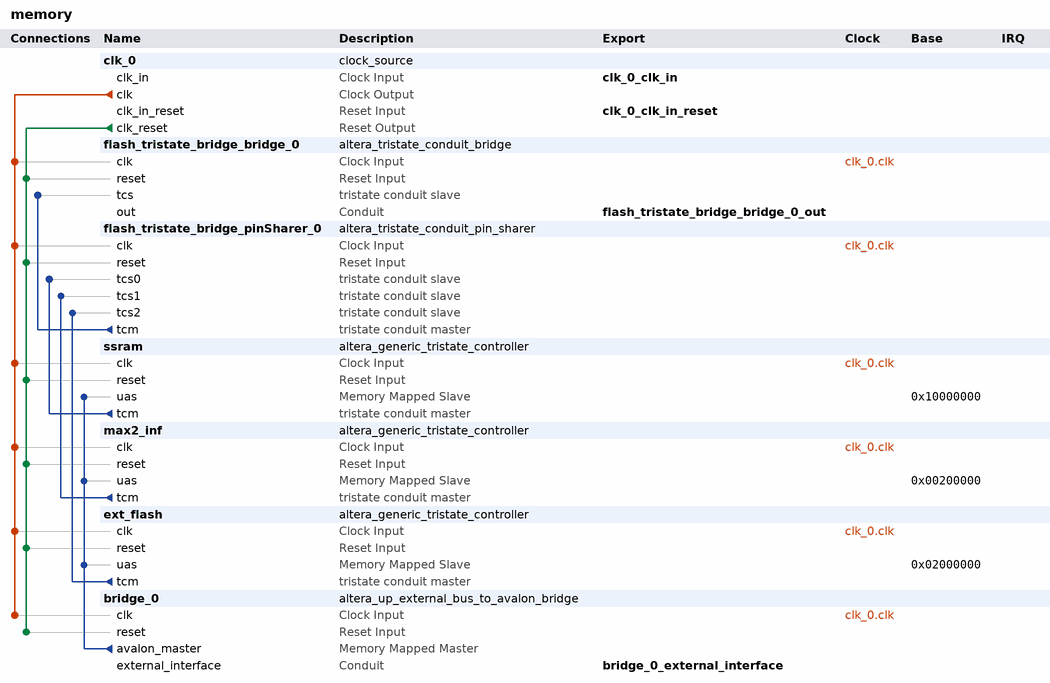
[diagram p0: system contents]
# Platform Designer (Qsys) system memory, Arria V 5AGXFB3H4F35C4
# Parameters at their usual value, and those the tool derives, are not listed.
package require -exact qsys 20.1
create_system memory
set_project_property DEVICE_FAMILY {Arria V}
set_project_property DEVICE 5AGXFB3H4F35C4

add_instance clk_0 clock_source 20.1
set_instance_parameter_value clk_0 clockFrequency 100000000

add_instance flash_tristate_bridge_bridge_0 altera_tristate_conduit_bridge 20.1

add_instance flash_tristate_bridge_pinSharer_0 altera_tristate_conduit_pin_sharer 20.1
set_instance_parameter_value flash_tristate_bridge_pinSharer_0 MODULE_ORIGIN_LIST ext_flash.tcm,ext_flash.tcm,ext_flash.tcm,ext_flash.tcm,ext_flash.tcm,max2_inf.tcm,max2_inf.tcm,max2_inf.tcm,max2_inf.tcm,max2_inf.tcm,max2_inf.tcm,max2_inf.tcm,max2_inf.tcm,ssram.tcm,ssram.tcm,ssram.tcm,ssram.tcm,ssram.tcm,ssram.tcm,ssram.tcm,ssram.tcm
set_instance_parameter_value flash_tristate_bridge_pinSharer_0 NUM_INTERFACES 3
set_instance_parameter_value flash_tristate_bridge_pinSharer_0 SHARED_SIGNAL_LIST flash_tristate_bridge_address,read_n_to_the_ext_flash,write_n_to_the_ext_flash,flash_tristate_bridge_data,select_n_to_the_ext_flash,chipenable1_n_to_the_max2_inf,bw_n_to_the_max2_inf,outputenable_n_to_the_max2_inf,bwe_n_to_the_max2_inf,flash_tristate_bridge_data,flash_tristate_bridge_address,reset_n_to_the_max2_inf,adsc_n_to_the_max2_inf,chipenable1_n_to_the_ssram,bw_n_to_the_ssram,outputenable_n_to_the_ssram,bwe_n_to_the_ssram,flash_tristate_bridge_data,flash_tristate_bridge_address,reset_n_to_the_ssram,adsc_n_to_the_ssram
set_instance_parameter_value flash_tristate_bridge_pinSharer_0 SIGNAL_ORIGIN_LIST address,read_n,write_n,data,chipselect_n,chipselect_n,byteenable_n,outputenable_n,write_n,data,address,reset_n,begintransfer_n,chipselect_n,byteenable_n,outputenable_n,write_n,data,address,reset_n,begintransfer_n

add_instance ssram altera_generic_tristate_controller 20.1
set_instance_parameter_value ssram ACTIVE_LOW_BEGINTRANSFER 1
set_instance_parameter_value ssram ACTIVE_LOW_BYTEENABLE 1
set_instance_parameter_value ssram ACTIVE_LOW_OUTPUTENABLE 1
set_instance_parameter_value ssram ACTIVE_LOW_READ 0
set_instance_parameter_value ssram ACTIVE_LOW_RESET_OUTPUT 1
set_instance_parameter_value ssram CHIPSELECT_THROUGH_READLATENCY 1
set_instance_parameter_value ssram INTERFACE_ASSIGNMENT_KEYS embeddedsw.configuration.isMemoryDevice
set_instance_parameter_value ssram INTERFACE_ASSIGNMENT_VALUES 1
set_instance_parameter_value ssram MODULE_ASSIGNMENT_KEYS embeddedsw.configuration.hwClassnameDriverSupportList,embeddedsw.CMacro.SRAM_MEMORY_SIZE,embeddedsw.CMacro.SRAM_MEMORY_UNITS,embeddedsw.CMacro.SSRAM_DATA_WIDTH,embeddedsw.CMacro.SSRAM_READ_LATENCY,embeddedsw.memoryInfo.MEM_INIT_DATA_WIDTH,embeddedsw.memoryInfo.HAS_BYTE_LANE,embeddedsw.memoryInfo.GENERATE_DAT_SYM,embeddedsw.memoryInfo.DAT_SYM_INSTALL_DIR
set_instance_parameter_value ssram MODULE_ASSIGNMENT_VALUES altera_avalon_lan91c111:altera_avalon_cfi_flash,2,1048576,32,2,32,1,1,SIM_DIR
set_instance_parameter_value ssram TCM_ADDRESS_W 21
set_instance_parameter_value ssram TCM_BYTEENABLE_W 4
set_instance_parameter_value ssram TCM_DATA_HOLD 0
set_instance_parameter_value ssram TCM_DATA_W 32
set_instance_parameter_value ssram TCM_MAX_PENDING_READ_TRANSACTIONS 5
set_instance_parameter_value ssram TCM_READLATENCY 4
set_instance_parameter_value ssram TCM_READ_WAIT 0
set_instance_parameter_value ssram TCM_SETUP_WAIT 0
set_instance_parameter_value ssram TCM_SYMBOLS_PER_WORD 4
set_instance_parameter_value ssram TCM_TIMING_UNITS 1
set_instance_parameter_value ssram TCM_TURNAROUND_TIME 2
set_instance_parameter_value ssram TCM_WRITE_WAIT 0
set_instance_parameter_value ssram USE_BEGINTRANSFER 1
set_instance_parameter_value ssram USE_BYTEENABLE 1
set_instance_parameter_value ssram USE_OUTPUTENABLE 1
set_instance_parameter_value ssram USE_READ 0
set_instance_parameter_value ssram USE_RESET_OUTPUT 1

add_instance max2_inf altera_generic_tristate_controller 20.1
set_instance_parameter_value max2_inf ACTIVE_LOW_BEGINTRANSFER 1
set_instance_parameter_value max2_inf ACTIVE_LOW_BYTEENABLE 1
set_instance_parameter_value max2_inf ACTIVE_LOW_OUTPUTENABLE 1
set_instance_parameter_value max2_inf ACTIVE_LOW_READ 0
set_instance_parameter_value max2_inf ACTIVE_LOW_RESET_OUTPUT 1
set_instance_parameter_value max2_inf CHIPSELECT_THROUGH_READLATENCY 1
set_instance_parameter_value max2_inf INTERFACE_ASSIGNMENT_KEYS embeddedsw.configuration.isMemoryDevice
set_instance_parameter_value max2_inf INTERFACE_ASSIGNMENT_VALUES 1
set_instance_parameter_value max2_inf MODULE_ASSIGNMENT_KEYS embeddedsw.configuration.hwClassnameDriverSupportList,embeddedsw.CMacro.SRAM_MEMORY_SIZE,embeddedsw.CMacro.SRAM_MEMORY_UNITS,embeddedsw.CMacro.SSRAM_DATA_WIDTH,embeddedsw.CMacro.SSRAM_READ_LATENCY,embeddedsw.memoryInfo.MEM_INIT_DATA_WIDTH,embeddedsw.memoryInfo.HAS_BYTE_LANE,embeddedsw.memoryInfo.GENERATE_DAT_SYM,embeddedsw.memoryInfo.DAT_SYM_INSTALL_DIR
set_instance_parameter_value max2_inf MODULE_ASSIGNMENT_VALUES altera_avalon_lan91c111:altera_avalon_cfi_flash,1,1048576,32,2,32,1,1,SIM_DIR
set_instance_parameter_value max2_inf TCM_ADDRESS_W 20
set_instance_parameter_value max2_inf TCM_BYTEENABLE_W 4
set_instance_parameter_value max2_inf TCM_DATA_HOLD 0
set_instance_parameter_value max2_inf TCM_DATA_W 32
set_instance_parameter_value max2_inf TCM_MAX_PENDING_READ_TRANSACTIONS 5
set_instance_parameter_value max2_inf TCM_READLATENCY 4
set_instance_parameter_value max2_inf TCM_READ_WAIT 0
set_instance_parameter_value max2_inf TCM_SETUP_WAIT 0
set_instance_parameter_value max2_inf TCM_SYMBOLS_PER_WORD 4
set_instance_parameter_value max2_inf TCM_TIMING_UNITS 1
set_instance_parameter_value max2_inf TCM_TURNAROUND_TIME 2
set_instance_parameter_value max2_inf TCM_WRITE_WAIT 0
set_instance_parameter_value max2_inf USE_BEGINTRANSFER 1
set_instance_parameter_value max2_inf USE_BYTEENABLE 1
set_instance_parameter_value max2_inf USE_OUTPUTENABLE 1
set_instance_parameter_value max2_inf USE_READ 0
set_instance_parameter_value max2_inf USE_RESET_OUTPUT 1

add_instance ext_flash altera_generic_tristate_controller 20.1
set_instance_parameter_value ext_flash ACTIVE_LOW_BEGINTRANSFER 0
set_instance_parameter_value ext_flash ACTIVE_LOW_BYTEENABLE 0
set_instance_parameter_value ext_flash ACTIVE_LOW_OUTPUTENABLE 0
set_instance_parameter_value ext_flash ACTIVE_LOW_READ 1
set_instance_parameter_value ext_flash CHIPSELECT_THROUGH_READLATENCY 0
set_instance_parameter_value ext_flash INTERFACE_ASSIGNMENT_KEYS embeddedsw.configuration.isFlash,embeddedsw.configuration.isMemoryDevice,embeddedsw.configuration.isNonVolatileStorage
set_instance_parameter_value ext_flash INTERFACE_ASSIGNMENT_VALUES 1,1,1
set_instance_parameter_value ext_flash MODULE_ASSIGNMENT_KEYS embeddedsw.configuration.hwClassnameDriverSupportList,embeddedsw.configuration.hwClassnameDriverSupportDefault,embeddedsw.CMacro.SETUP_VALUE,embeddedsw.CMacro.WAIT_VALUE,embeddedsw.CMacro.HOLD_VALUE,embeddedsw.CMacro.TIMING_UNITS,embeddedsw.CMacro.SIZE,embeddedsw.memoryInfo.MEM_INIT_DATA_WIDTH,embeddedsw.memoryInfo.HAS_BYTE_LANE,embeddedsw.memoryInfo.IS_FLASH,embeddedsw.memoryInfo.GENERATE_DAT_SYM,embeddedsw.memoryInfo.GENERATE_FLASH,embeddedsw.memoryInfo.DAT_SYM_INSTALL_DIR,embeddedsw.memoryInfo.FLASH_INSTALL_DIR
set_instance_parameter_value ext_flash MODULE_ASSIGNMENT_VALUES {altera_avalon_lan91c111:altera_avalon_cfi_flash,altera_avalon_cfi_flash,25,100,20,"ns",33554432u,16,1,1,1,1,SIM_DIR,APP_DIR}
set_instance_parameter_value ext_flash TCM_ADDRESS_W 25
set_instance_parameter_value ext_flash TCM_BYTEENABLE_W 2
set_instance_parameter_value ext_flash TCM_DATA_HOLD 20
set_instance_parameter_value ext_flash TCM_DATA_W 16
set_instance_parameter_value ext_flash TCM_MAX_PENDING_READ_TRANSACTIONS 3
set_instance_parameter_value ext_flash TCM_READLATENCY 2
set_instance_parameter_value ext_flash TCM_READ_WAIT 100
set_instance_parameter_value ext_flash TCM_SETUP_WAIT 25
set_instance_parameter_value ext_flash TCM_SYMBOLS_PER_WORD 2
set_instance_parameter_value ext_flash TCM_TIMING_UNITS 0
set_instance_parameter_value ext_flash TCM_TURNAROUND_TIME 2
set_instance_parameter_value ext_flash TCM_WRITE_WAIT 100
set_instance_parameter_value ext_flash USE_BEGINTRANSFER 0
set_instance_parameter_value ext_flash USE_BYTEENABLE 0
set_instance_parameter_value ext_flash USE_OUTPUTENABLE 0
set_instance_parameter_value ext_flash USE_READ 1

add_instance bridge_0 altera_up_external_bus_to_avalon_bridge 18.0
set_instance_parameter_value bridge_0 addr_size 1024
set_instance_parameter_value bridge_0 addr_size_multiplier Mbytes
set_instance_parameter_value bridge_0 data_size 128

# connections
add_connection clk_0.clk bridge_0.clk clock
add_connection clk_0.clk ext_flash.clk clock
add_connection clk_0.clk flash_tristate_bridge_bridge_0.clk clock
add_connection clk_0.clk flash_tristate_bridge_pinSharer_0.clk clock
add_connection clk_0.clk max2_inf.clk clock
add_connection clk_0.clk ssram.clk clock
add_connection clk_0.clk_reset bridge_0.reset reset
add_connection clk_0.clk_reset ext_flash.reset reset
add_connection clk_0.clk_reset flash_tristate_bridge_bridge_0.reset reset
add_connection clk_0.clk_reset flash_tristate_bridge_pinSharer_0.reset reset
add_connection clk_0.clk_reset max2_inf.reset reset
add_connection clk_0.clk_reset ssram.reset reset
add_connection bridge_0.avalon_master ext_flash.uas avalon
set_connection_parameter_value bridge_0.avalon_master/ext_flash.uas baseAddress 0x02000000
add_connection bridge_0.avalon_master max2_inf.uas avalon
set_connection_parameter_value bridge_0.avalon_master/max2_inf.uas baseAddress 0x00200000
add_connection bridge_0.avalon_master ssram.uas avalon
set_connection_parameter_value bridge_0.avalon_master/ssram.uas baseAddress 0x10000000
add_connection ext_flash.tcm flash_tristate_bridge_pinSharer_0.tcs2 tristate_conduit
add_connection flash_tristate_bridge_pinSharer_0.tcm flash_tristate_bridge_bridge_0.tcs tristate_conduit
add_connection max2_inf.tcm flash_tristate_bridge_pinSharer_0.tcs1 tristate_conduit
add_connection ssram.tcm flash_tristate_bridge_pinSharer_0.tcs0 tristate_conduit

# exported interfaces
add_interface bridge_0_external_interface conduit end
set_interface_property bridge_0_external_interface EXPORT_OF bridge_0.external_interface
add_interface clk_0_clk_in clock sink
set_interface_property clk_0_clk_in EXPORT_OF clk_0.clk_in
add_interface clk_0_clk_in_reset reset sink
set_interface_property clk_0_clk_in_reset EXPORT_OF clk_0.clk_in_reset
add_interface flash_tristate_bridge_bridge_0_out conduit end
set_interface_property flash_tristate_bridge_bridge_0_out EXPORT_OF flash_tristate_bridge_bridge_0.out

set_interconnect_requirement {$system} qsys_mm.burstAdapterImplementation PER_BURST_TYPE_CONVERTER
set_interconnect_requirement {$system} qsys_mm.clockCrossingAdapter FIFO
set_interconnect_requirement {$system} qsys_mm.maxAdditionalLatency 4

save_system memory.qsys
